# EAGLE design aard-mod (EAGLE 6.3)
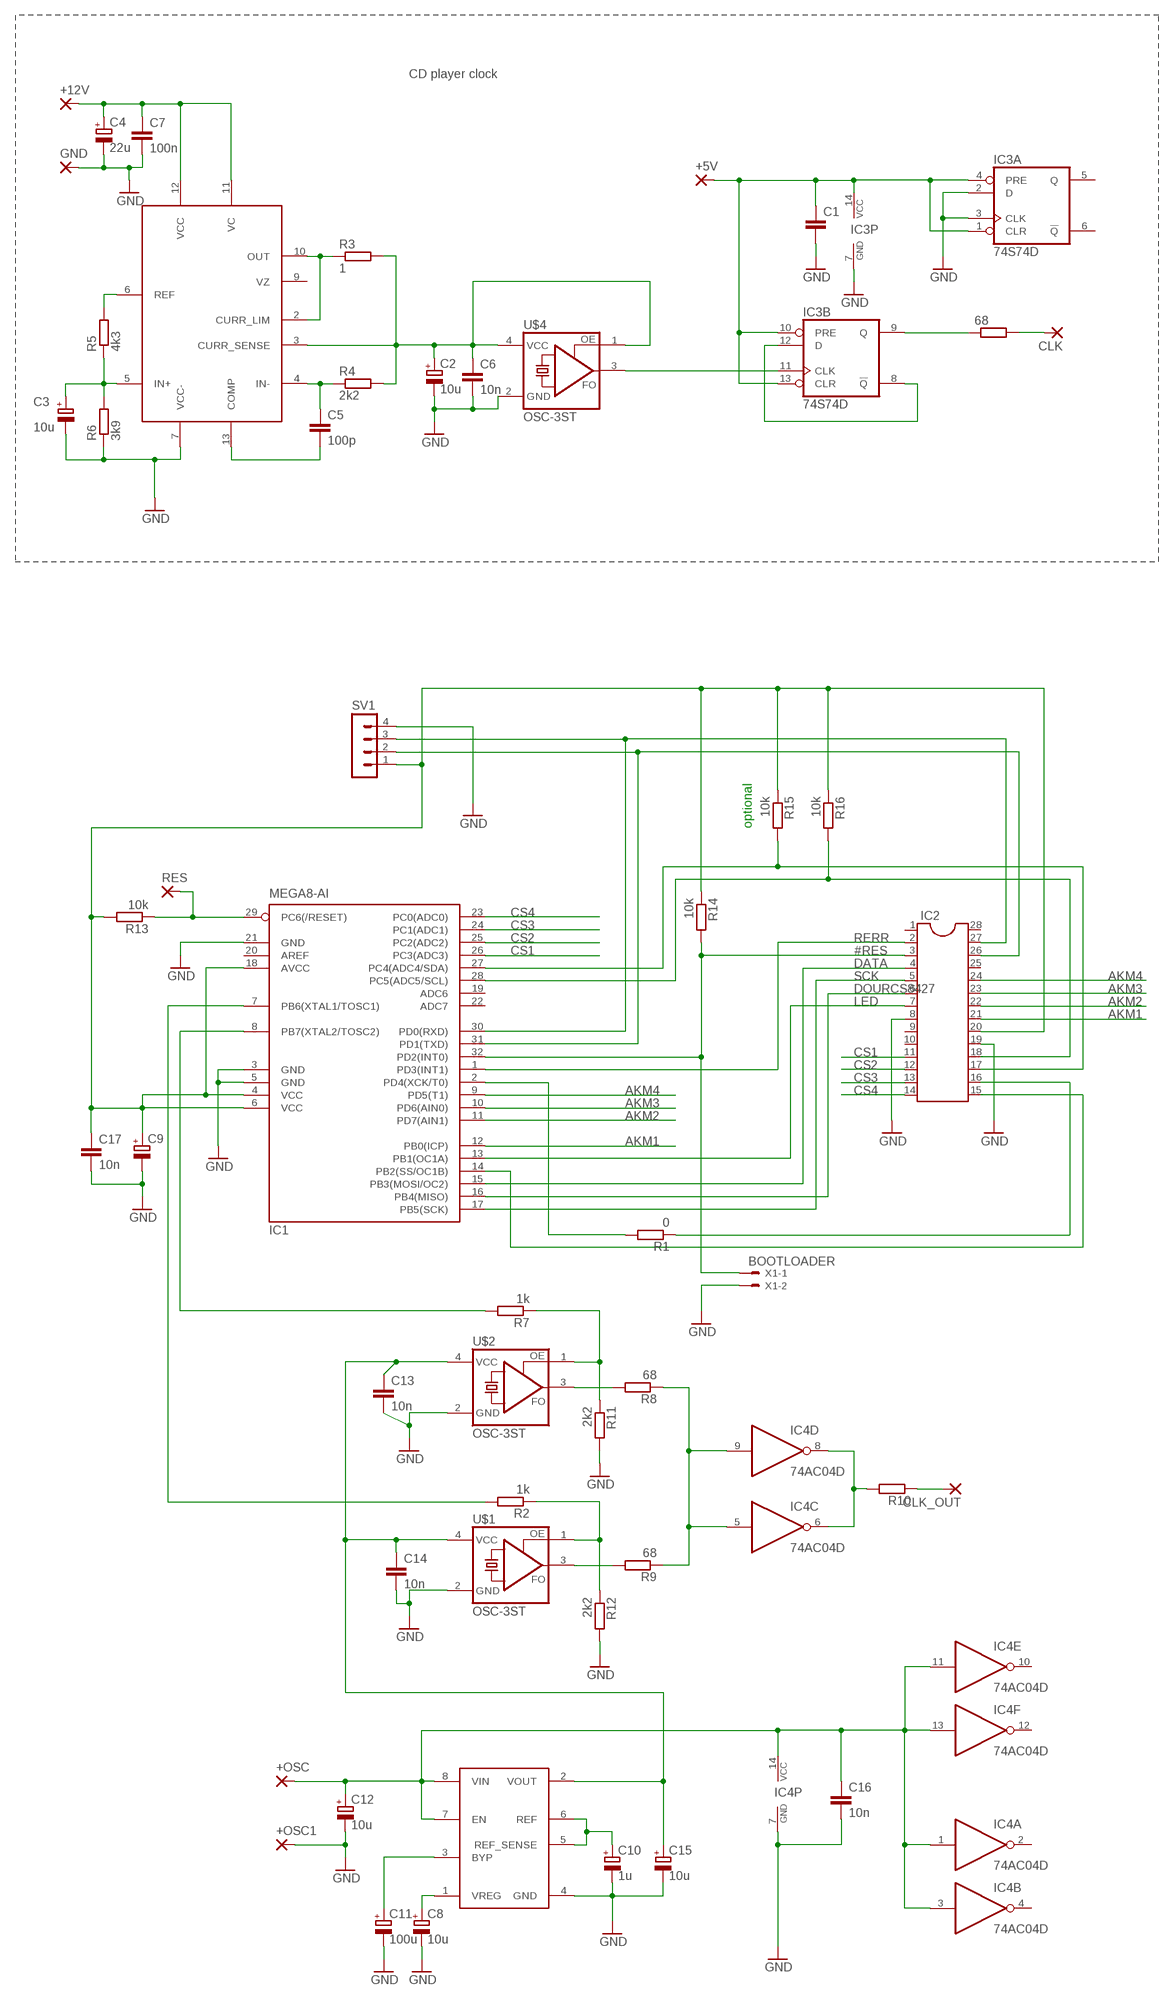
[diagram p0: schematic, sheet 1]

## Parts
68  R-EU_M1206  [M1206]
+5V  2,54/1,0  [2,54/1,0]
+12V  2,54/1,0  [2,54/1,0]
+OSC  2,54/1,0  [2,54/1,0]
+OSC1  2,54/1,0  [2,54/1,0]
C1  C-EUC1206K  [C1206K]
C2  10u  CPOL-EUSMCB  [SMC_B]
C3  10u  CPOL-EUSMCD  [SMC_D]
C4  22u  CPOL-EUSMCD  [SMC_D]
C5  100p  C-EUC0805K  [C0805K]
C6  10n  C-EUC0805K  [C0805K]
C7  100n  C-EUC1206K  [C1206K]
C8  10u  CPOL-EUSMCB  [SMC_B]
C9  CPOL-EUSMCB  [SMC_B]
C10  1u  CPOL-EUSMCB  [SMC_B]
C11  100u  CPOL-EUSMCD  [SMC_D]
C12  10u  CPOL-EUSMCD  [SMC_D]
C13  10n  C-EUC1206  [C1206]
C14  10n  C-EUC1206  [C1206]
C15  10u  CPOL-EUSMCB  [SMC_B]
C16  10n  C-EUC1206  [C1206]
C17  10n  C-EUC0805K  [C0805K]
CLK  2,54/1,0  [2,54/1,0]
CLK_OUT  2,54/1,0  [2,54/1,0]
GND  2,54/1,0  [2,54/1,0]
IC1  MEGA8-AI  [TQFP32-08]
IC2  DIL28-3  [DIL28-3]
IC3  74S74D  [SO14]
IC4  74AC04D  [SO14]
R1  0  R-EU_R1206  [R1206]
R2  1k  R-EU_R1206  [R1206]
R3  1  R-EU_M1206  [M1206]
R4  2k2  R-EU_R0805  [R0805]
R5  4k3  R-EU_R0805  [R0805]
R6  3k9  R-EU_R0805  [R0805]
R7  1k  R-EU_R1206  [R1206]
R8  68  R-EU_R1206  [R1206]
R9  68  R-EU_R1206  [R1206]
R10  R-EU_R0805  [R0805]
R11  2k2  R-EU_R0805  [R0805]
R12  2k2  R-EU_R0805  [R0805]
R13  10k  R-EU_R1206  [R1206]
R14  10k  R-EU_R1206  [R1206]
R15  10k  R-EU_R1206  [R1206]
R16  10k  R-EU_R1206  [R1206]
RES  2,54/1,0  [2,54/1,0]
SV1  MA04-1  [MA04-1]
U$1  OSC-3ST  [OSC2X2.5]
U$2  OSC-3ST  [OSC2X2.5]
U$3  723  [SO14]
U$4  OSC-3ST  [OSC2X2.5]
U$5  ADM7150  [SO8-COOL]
X1  BOOTLOADER  22-23-2021  [22-23-2021]

## Nets
5V: +12V.1(P) C4.+ C7.1 U$3.11(VC) U$3.12(VCC)
#RES: IC1.32(PD2(INT0)) IC2.3 R14.2 X1.1
AKM1: IC1.12(PB0(ICP)) IC2.21
AKM2: IC1.11(PD7(AIN1)) IC2.22
AKM3: IC1.10(PD6(AIN0)) IC2.23
AKM4: IC1.9(PD5(T1)) IC2.24
CS1: IC1.26(PC3(ADC3)) IC2.11
CS2: IC1.25(PC2(ADC2)) IC2.12
CS3: IC1.24(PC1(ADC1)) IC2.13
CS4: IC1.23(PC0(ADC0)) IC2.14
DATA: IC1.15(PB3(MOSI/OC2)) IC2.4
DOURCS8427: IC1.16(PB4(MISO)) IC2.6
GND: +OSC1.1(P) C1.2 C2.- C3.- C4.- C6.2 C7.2 C8.- C9.- C10.- C11.- C12.- C13.2 C14.2 C15.- C16.2 C17.2 GND.1(P) IC1.3(GND) IC1.5(GND) IC1.21(GND) IC2.8 IC2.19 IC3.2(A:D) IC3.3(A:CLK) IC3.7(P:GND) IC4.7(P:GND) R6.1 R11.2 R12.2 SV1.4 U$1.2(GND) U$2.2(GND) U$3.7(VCC-) U$4.2(GND) U$5.4(GND) X1.2
LED: IC1.13(PB1(OC1A)) IC2.7
N$1: IC1.2(PD4(XCK/T0)) R1.2
N$3: IC1.14(PB2(SS/OC1B)) IC2.15
N$5: IC1.28(PC5(ADC5/SCL)) IC2.18 R16.2
N$6: IC1.27(PC4(ADC4/SDA)) IC2.17 R15.2
N$13: IC1.30(PD0(RXD)) IC2.27 SV1.3
N$14: IC1.8(PB7(XTAL2/TOSC2)) R7.2
N$15: IC1.31(PD1(TXD)) IC2.26 SV1.2
N$17: IC2.16 R1.1
N$18: IC1.7(PB6(XTAL1/TOSC1)) R2.2
N$19: C10.+ U$5.5(REF_SENSE) U$5.6(REF)
N$21: C8.+ U$5.1(VREG)
N$22: C11.+ U$5.3(BYP)
N$23: +OSC.1(P) C12.+ C16.1 IC4.1(A:I) IC4.3(B:I) IC4.11(E:I) IC4.13(F:I) IC4.14(P:VCC) U$5.7(EN) U$5.8(VIN)
N$24: C13.1 C14.1 C15.+ U$1.4(VCC) U$2.4(VCC) U$5.2(VOUT)
N$25: C9.+ C17.1 IC1.4(VCC) IC1.6(VCC) IC1.18(AVCC) IC2.20 R13.2 R14.1 R15.1 R16.1 SV1.1
N$26: IC3.8(B:!Q) IC3.12(B:D)
N$27: IC3.11(B:CLK) U$4.3(FO)
N$28: +5V.1(P) C1.1 IC3.1(A:CLR) IC3.4(A:PRE) IC3.10(B:PRE) IC3.13(B:CLR) IC3.14(P:VCC)
N$29: IC4.6(C:O) IC4.8(D:O) R10.2
N$30: CLK_OUT.1(P) R10.1
N$31: C5.2 U$3.13(COMP)
N$32: R3.1 U$3.2(CURR_LIM) U$3.10(OUT)
N$33: C5.1 R4.1 U$3.4(IN-)
N$34: C2.+ C6.1 R3.2 R4.2 U$3.3(CURR_SENSE) U$4.1(OE) U$4.4(VCC)
N$35: R5.2 U$3.6(REF)
N$36: C3.+ R5.1 R6.2 U$3.5(IN+)
N$37: R8.2 U$2.3(FO)
N$38: R7.1 R11.1 U$2.1(OE)
N$39: R2.1 R12.1 U$1.1(OE)
N$40: 68.2 CLK.1(P)
N$41: R9.2 U$1.3(FO)
N$42: IC4.5(C:I) IC4.9(D:I) R8.1 R9.1
N$44: IC1.29(PC6(/RESET)) R13.1 RES.1(P)
N$45: 68.1 IC3.9(B:Q)
RERR: IC1.1(PD3(INT1)) IC2.2
SCK: IC1.17(PB5(SCK)) IC2.5
Unconnected: IC1.19(ADC6) IC1.20(AREF) IC1.22(ADC7) IC2.1 IC2.9 IC2.10 IC2.25 IC2.28 IC3.5(A:Q) IC3.6(A:!Q) IC4.2(A:O) IC4.4(B:O) IC4.10(E:O) IC4.12(F:O) U$3.9(VZ)

## Notes on the sheet
- CD player clock
- optional

## Library data of the parts
68 R1-R16 = rcl:R-EU_: RESISTOR, European symbol
+5V +12V +OSC +OSC1 CLK CLK_OUT GND RES = wirepad:2,54/1,0: THROUGH-HOLE PAD
C1 C5-C7 C13 C14 C16 C17 = rcl:C-EU: CAPACITOR, European symbol
C2-C4 C8-C12 C15 = rcl:CPOL-EU: POLARIZED CAPACITOR, European symbol
IC1 = atmel:MEGA8: MICROCONTROLLER 8 Kbytes FLASH, 1 kbytes SRAM, 512 bytes EEPROM, USART, 6-channel 10 bit ADC, 2-channel 8 bit ADC Pin compatible with Atmega48, ATMega88, ATMega168 Source: avr.lbr; MPN: ATMEGA8-16AU; OC_FARNELL: 9171371; OC_NEWARK: 73M8863
IC2 = ic-package:DIL28: Dual In Line
IC3 = 74xx-eu:74*74: Dual D type positive edge triggered FLIP FLOP, preset and clear
IC4 = 74xx-eu:74*04: Hex INVERTER
SV1 = con-lstb:MA04-1: PIN HEADER; OC_FARNELL: unknown; OC_NEWARK: unknown
U$1 U$2 U$4 = ndk:OSC-3ST
U$3 = v-reg-3:723
U$5 = analog-devices:ADM7150
X1 = con-molex:22-23-2021: .100" (2.54mm) Center Header - 2 Pin; MF: MOLEX; MPN: 22-23-2021; OC_FARNELL: 1462926; OC_NEWARK: 25C3832

## Board
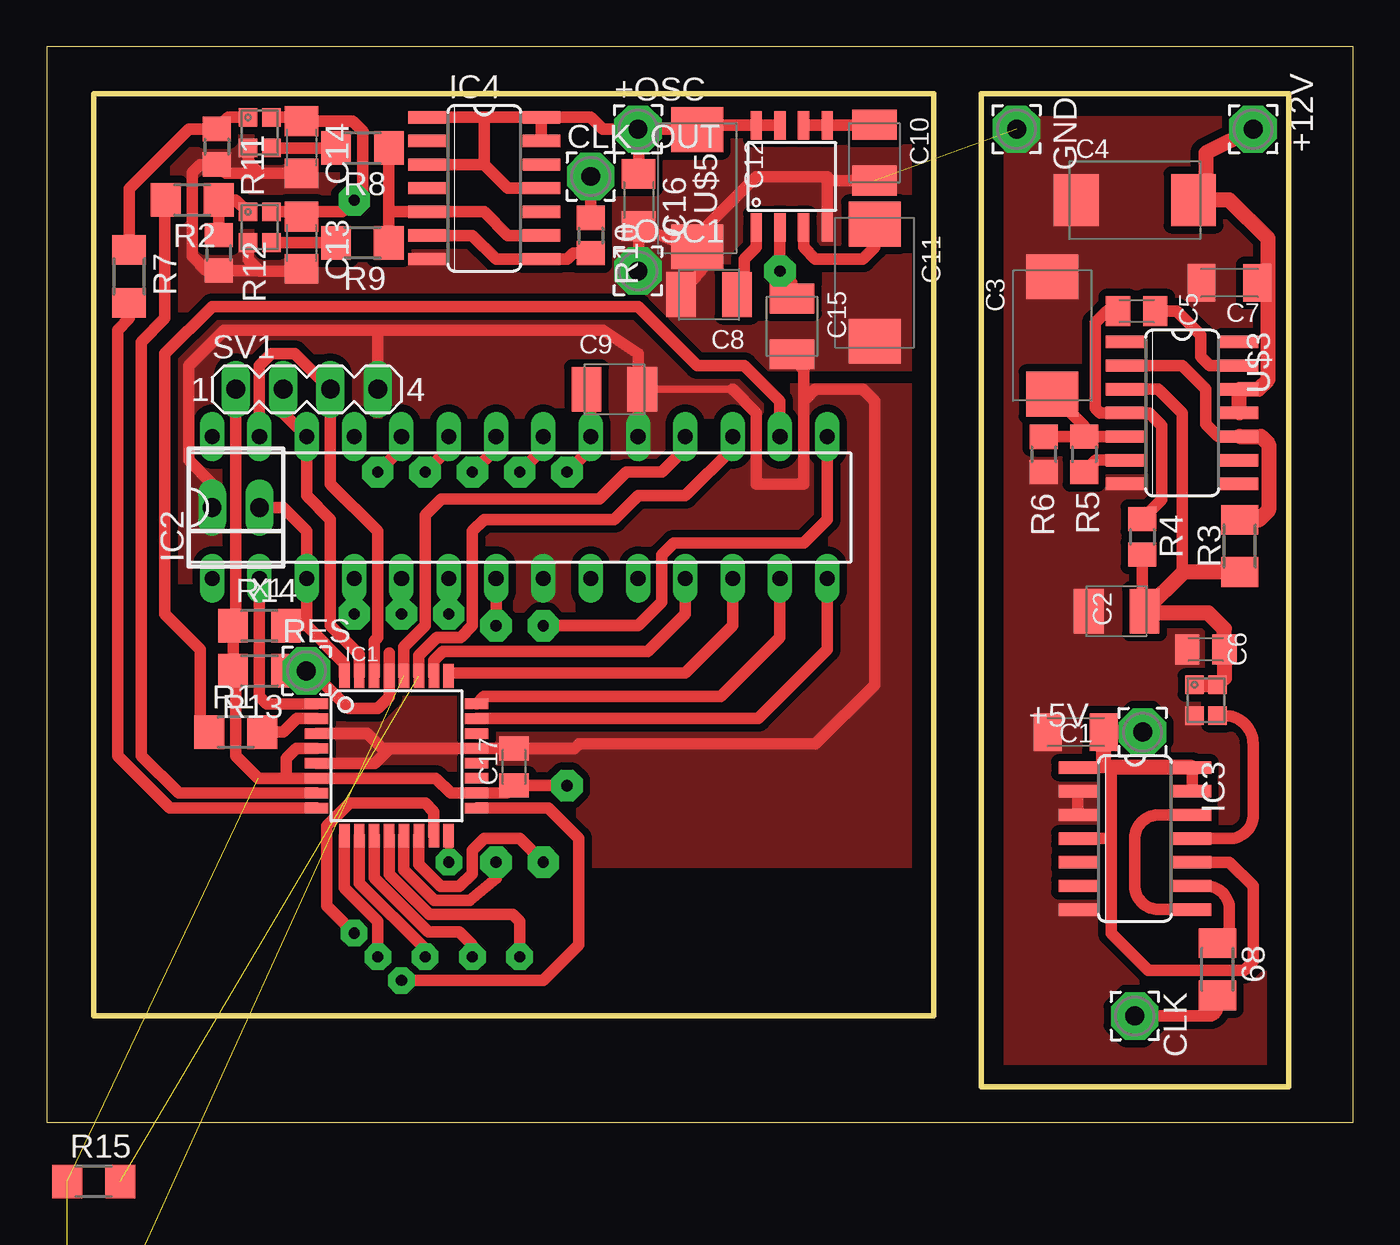
[diagram p1: board, top side]
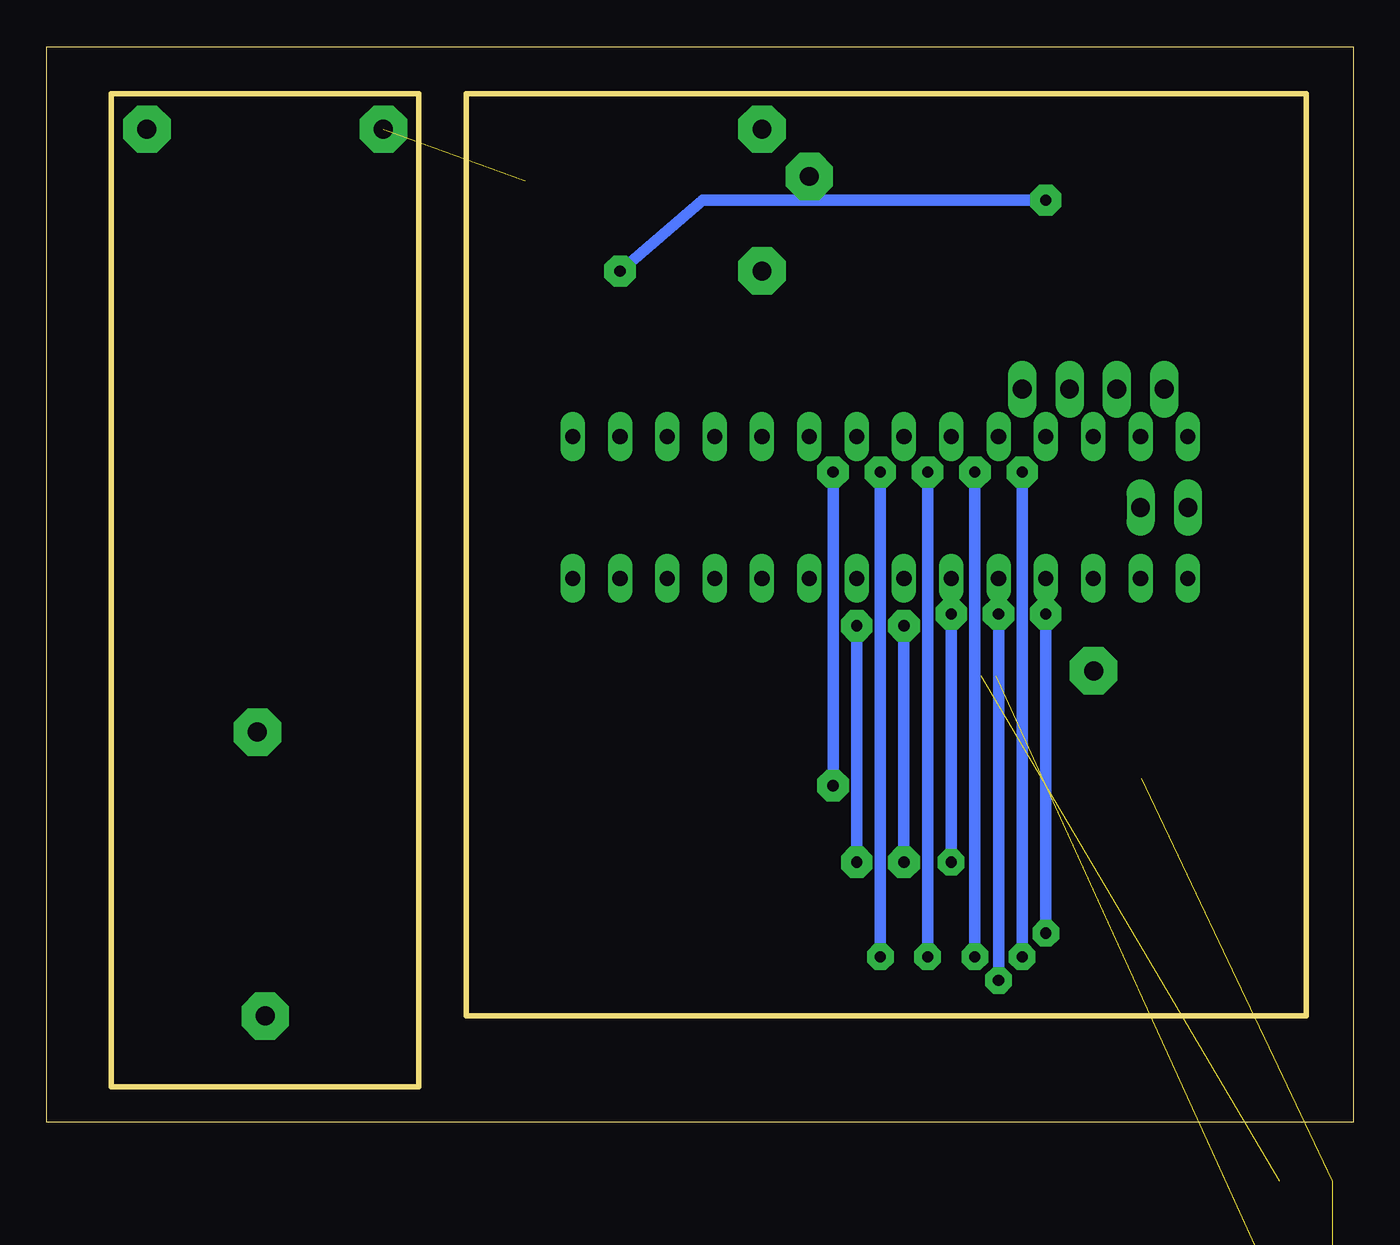
[diagram p2: board, bottom side, seen from below]

Size 70.16 x 57.78 mm. Coordinates in mm from the lower left corner, seen from the top.
Outline: 0,0 70.16,0 70.16,57.78 0,57.78 0,0
Outline: 2.54,55.25 47.62,55.25 47.62,5.71 2.54,5.71 2.54,55.25
Outline: 50.17,55.25 66.67,55.25 66.67,1.91 50.17,1.91 50.17,55.25
Copper layers (1*16): Top 0.035mm / dielectric 1.5mm / Bottom 0.035mm
Design rules "default": minimum track width 10mil, minimum drill 24mil, track to track 8mil, track to pad 8mil, pad to pad 8mil, via to via 8mil, smd to smd 8mil, copper to edge 40mil, drill to drill 8mil, minimum pad ring 10mil, minimum via ring 8mil, stop-mask expansion 4mil, vias tented up to drill 0mil, thermal gap 10mil

### Footprints (pad centres in the part's own frame; a part is rotated, then mirrored left to right if it is on the bottom)
M1206 = smd 1.6 x 2: 1 -1.4,0; 2 1.4,0
2,54/1,0 = drill 1.016 pad 2.54 octagon: 1 0,0
C1206K = smd 1.5 x 2: 1 -1.5,0; 2 1.5,0
SMC_B = smd 1.6 x 2.4: + -1.5,0; - 1.5,0
SMC_D = smd 2.4 x 2.8: + -3.15,0; - 3.15,0
C0805K = smd 1.3 x 1.6: 1 -1,0; 2 1,0
C1206 = smd 1.6 x 1.8: 1 -1.4,0; 2 1.4,0
TQFP32-08 = smd 1.27 x 0.559: 1 -4.293,2.8; 2 -4.293,2; 3 -4.293,1.2; 4 -4.293,0.4; 5 -4.293,-0.4; 6 -4.293,-1.2; 7 -4.293,-2; 8 -4.293,-2.8; 17 4.293,-2.8; 18 4.293,-2; 19 4.293,-1.2; 20 4.293,-0.4; 21 4.293,0.4; 22 4.293,1.2; 23 4.293,2; 24 4.293,2.8 | smd 0.559 x 1.27: 9 -2.8,-4.293; 10 -2,-4.293; 11 -1.2,-4.293; 12 -0.4,-4.293; 13 0.4,-4.293; 14 1.2,-4.293; 15 2,-4.293; 16 2.8,-4.293; 25 2.8,4.293; 26 2,4.293; 27 1.2,4.293; 28 0.4,4.293; 29 -0.4,4.293; 30 -1.2,4.293; 31 -2,4.293; 32 -2.8,4.293
DIL28-3 = drill 0.813 long: 1 -16.51,-3.81; 2 -13.97,-3.81; 3 -11.43,-3.81; 4 -8.89,-3.81; 5 -6.35,-3.81; 6 -3.81,-3.81; 7 -1.27,-3.81; 8 1.27,-3.81; 9 3.81,-3.81; 10 6.35,-3.81; 11 8.89,-3.81; 12 11.43,-3.81; 13 13.97,-3.81; 14 16.51,-3.81; 15 16.51,3.81; 16 13.97,3.81; 17 11.43,3.81; 18 8.89,3.81; 19 6.35,3.81; 20 3.81,3.81; 21 1.27,3.81; 22 -1.27,3.81; 23 -3.81,3.81; 24 -6.35,3.81; 25 -8.89,3.81; 26 -11.43,3.81; 27 -13.97,3.81; 28 -16.51,3.81
SO14 = smd 0.66 x 2.032: 1 -3.81,-3.073; 2 -2.54,-3.073; 3 -1.27,-3.073; 4 0,-3.073; 5 1.27,-3.073; 6 2.54,-3.073; 7 3.81,-3.073; 8 3.81,3.073; 9 2.54,3.073; 10 1.27,3.073; 11 0,3.073; 12 -1.27,3.073; 13 -2.54,3.073; 14 -3.81,3.073
R1206 = smd 1.6 x 1.803: 1 -1.422,0; 2 1.422,0
R0805 = smd 1.3 x 1.5: 1 -0.95,0; 2 0.95,0
MA04-1 = drill 1.016 long: 1 -3.81,0; 2 -1.27,0; 3 1.27,0; 4 3.81,0
OSC2X2.5 = smd 1 x 1: 1 0,-1.25; 2 1.65,-1.25; 3 1.65,0; 4 0,0
SO8-COOL = smd 0.61 x 1.524: 1 -1.905,-2.743; 2 -0.635,-2.743; 3 0.635,-2.743; 4 1.905,-2.743; 5 1.905,2.743; 6 0.635,2.743; 7 -0.635,2.743; 8 -1.905,2.743
22-23-2021 = drill 1 long: 1 -1.27,0; 2 1.27,0

### Placement (x,y rotation side)
68  62.86,8.23 270 top
+5V  58.83,20.96 270 top
+12V  64.77,53.34 270 top
+OSC  31.75,53.34 0 top
+OSC1  31.75,45.72 0 top
C1  55.25,20.95 180 top
C2  57.44,27.45 180 top
C3  53.99,42.26 90 top
C4  58.42,49.53 180 top
C5  58.52,43.57 0 top
C6  62.23,25.4 180 top
C7  63.5,45.08 180 top
C8  35.56,44.45 180 top
C9  30.48,39.37 0 top
C10  44.45,52.07 270 top
C11  44.45,45.08 270 top
C12  34.93,50.17 270 top
C13  13.69,47.23 270 top
C14  13.69,52.37 270 top
C15  40.02,42.75 270 top
C16  31.79,49.53 270 top
C17  25.1,19.09 90 top
CLK  58.42,5.71 270 top
CLK_OUT  29.21,50.8 0 top
GND  52.07,53.34 270 top
IC1  18.79,19.68 0 top
IC2  25.4,33.02 0 top
IC3  58.42,15.24 270 top
IC4  23.5,50.17 270 top
R1  10.16,20.95 0 top
R2  7.81,49.54 180 top
R3  64.05,30.96 270 top
R4  58.82,31.45 270 top
R5  55.7,35.88 270 top
R6  53.54,35.87 90 top
R7  4.43,45.43 270 top
R8  16.96,52.32 180 top
R9  16.95,47.24 180 top
R10  29.21,47.62 270 top
R11  9.14,52.4 270 top
R12  9.24,46.69 270 top
R13  11.43,24.25 180 top
R14  11.43,26.67 0 top
R15  2.54,-3.18 0 top  (outside the outline)
R16  2.54,-9.53 0 top  (outside the outline)
RES  13.95,24.25 0 top
SV1  13.97,39.37 0 top
U$1  12.06,48.89 270 top
U$2  12.06,53.97 270 top
U$3  60.96,38.1 270 top
U$4  62.87,23.49 270 top
U$5  40.01,50.8 0 top
X1  10.16,33.02 180 top

### Tracks (layer width: path | path; a pad name or v marks a point on that pad's centre or on a via)
5V
  Top 0.61: C7.1 65.57,45.72
  Top 0.813: U$3.11 U$3.12 65.05,39.37 65.57,39.89 65.57,45.72 65.57,47.46 63.5,49.53 62.23,49.53 | 62.23,49.53 C4.+ | +12V.1 62.23,52.07 62.23,49.53
#RES
  Top 0.406: 13.97,30.48 IC2.3
  Top 0.61: 13.97,26.67 IC2.3 13.97,31.75 12.7,33.02 X1.1 | 13.97,26.67 R14.2 | IC1.32 15.99,24.65 13.97,26.67
AKM1  (via drill 0.6 pad 1.42, 0.6 pad 1.68)
  Top 0.61: IC1.12 18.39,13.33 20.55,11.17 25.03,11.17 25.4,10.8 v25.4,8.89 | IC2.21 26.67,36.2 v25.4,34.92
  Bottom 0.61: v25.4,34.92 v25.4,8.89
AKM2  (via drill 0.6 pad 1.42, 0.6 pad 1.68)
  Top 0.61: IC1.11 17.59,13.13 20.48,10.23 22.16,10.23 22.86,9.52 v22.86,8.89 | IC2.22 24.13,36.2 v22.86,34.92
  Bottom 0.61: v22.86,34.92 v22.86,8.89
AKM3  (via drill 0.6 pad 1.42, 0.6 pad 1.68)
  Top 0.61: IC1.10 16.78,12.84 20.32,9.31 v20.32,8.89 | IC2.23 21.59,36.2 v20.32,34.92
  Bottom 0.61: v20.32,34.92 v20.32,8.89
AKM4  (via drill 0.6 pad 1.42, 0.6 pad 1.68)
  Top 0.406: 17.78,9.61 v17.78,8.89
  Top 0.61: IC1.9 15.99,12.59 17.78,10.8 v17.78,8.89 | IC2.24 19.05,36.2 v17.78,34.92
  Bottom 0.61: v17.78,34.92 v17.78,8.89
CS1
  Top 0.61: IC1.26 20.79,24.81 21.26,25.28 32.27,25.28 34.29,27.3 IC2.11
CS2
  Top 0.406: 21.74,24.13 IC1.25
  Top 0.61: IC2.12 36.83,26.67 34.29,24.13 21.74,24.13
CS3
  Top 0.61: IC2.13 39.37,26.03 36.2,22.86 23.46,22.86 IC1.24
CS4
  Top 0.61: IC1.23 38.19,21.68 41.91,25.4 IC2.14
DATA  (via drill 0.6 pad 1.42, 0.6 pad 1.68)
  Top 0.61: IC2.4 v16.51,27.3 | IC1.15 20.79,16.68 20.32,17.14 16.27,17.14 15.04,15.91 15.04,11.63 v16.51,10.16
  Bottom 0.61: v16.51,27.3 v16.51,10.16
DOURCS8427  (via drill 0.6 pad 1.42, 0.6 pad 1.68)
  Top 0.406: IC1.16 v21.59,13.97
  Top 0.61: IC2.6 v21.59,27.3
  Bottom 0.61: v21.59,27.3 v21.59,13.97
GND  (1 unrouted)
  Top 0.406: 36.83,39.37 C9.-
  Top 0.61: IC3.2 IC3.3 | 18.41,20.08 IC1.21 C17.2 28.34,20.09 28.57,20.32 41.28,20.32 44.45,23.49 44.45,38.73 43.82,39.37 41.28,39.37 40.64,38.73 | 18.41,20.08 18.02,20.08 17.22,20.88 IC1.3 | IC1.5 17.61,19.28 18.41,20.08 | X1.2 8.89,34.29 7.62,35.56 7.62,40.64 9.53,42.55 17.78,42.55 | IC2.19 31.75,39.14 C9.- 31.75,39.6 31.75,41.28 29.84,42.55 17.78,42.55 | C14.2 11.43,50.97 | 11.43,50.97 9.62,50.97 R11.2 9.12,51.44 8.26,51.44 7.81,50.99 7.81,46.51 8.58,45.74 R12.2 11.41,45.74 | U$2.2 10.81,51.58 11.43,50.97 | U$1.2 10.81,46.33 11.41,45.74 | C13.2 13.57,45.72 11.43,45.72 11.41,45.74 | SV1.4 17.78,42.55 | U$5.4 41.91,50.8 | 41.91,50.8 38.1,50.8 34.93,47.62 C12.- | C12.- 34.93,46.99 34.8,46.86 C16.2 31.79,45.76 +OSC1.1 | C8.- 35.33,45.97 C12.- | C10.- 42.14,50.57 41.91,50.8 | 36.83,39.37 38.1,38.1 38.1,34.29 40.64,34.29 40.64,38.73 | 40.64,38.73 40.64,40.41 C15.-
  pour Top (isolate 0.406, no thermals): 66.04,54.61 66.04,2.54 50.8,2.54 50.8,54.61
  pour Top (isolate 0.406, no thermals): 46.36,40.64 34.93,40.64 31.75,43.81 6.35,43.81 6.35,53.97 46.36,53.97
  pour Top (isolate 0.406, no thermals): 6.35,43.81 31.75,43.81 34.93,40.64 37.47,40.64 38.74,39.37 46.36,39.37 46.36,13.97 15.24,13.97 15.24,29.21 6.35,29.21
LED  (via drill 0.6 pad 1.68)
  Top 0.61: IC2.7 v24.13,26.67 | IC1.13 19.19,13.55 20.8,11.93 22.73,11.93 24.13,13.11 v24.13,13.97
  Bottom 0.61: v24.13,26.67 v24.13,13.97
N$1
  Top 0.61: IC1.2 13.43,21.68 12.7,20.95 R1.2
N$2  (via drill 0.6 pad 1.68)
  other vias: 16.51,49.53
N$3  (via drill 0.6 pad 1.68)
  Top 0.61: IC2.15 41.91,32.38 40.64,31.12 33.66,31.12 33.02,30.48 33.02,27.94 31.75,26.67 v26.67,26.67 | IC1.14 19.99,13.84 21.16,12.67 22.14,12.67 22.86,13.34 22.86,14.6 23.5,15.24 25.4,15.24 v26.67,13.97
  Bottom 0.61: v26.67,26.67 v26.67,13.97
N$5  (1 unrouted)
  Top 0.61: IC1.28 19.19,25.54 20.32,26.67 20.32,32.6 21.19,33.47 29.66,33.47 31.11,34.92 33.02,34.92 34.29,36.2 IC2.18
N$6  (1 unrouted)
  Top 0.61: IC1.27 19.99,25.07 20.95,26.03 22.22,26.03 22.86,26.67 22.86,31.75 23.5,32.38 30.48,32.38 31.75,33.66 34.29,33.66 36.83,36.2 IC2.17
N$13
  Top 0.61: IC1.30 17.59,25.84 17.78,26.03 17.78,31.75 15.24,34.29 SV1.3 13.33,41.28 12.06,41.28 11.43,40.64 IC2.27
N$14
  Top 0.61: IC1.8 6.61,16.88 3.81,19.69 3.81,42.55 4.45,43.18 4.45,44 R7.2
N$15
  Top 0.61: IC1.31 16.79,25.12 15.24,26.67 15.24,32.38 13.97,33.66 IC2.26 12.7,38.1 SV1.2
N$17
  Top 0.61: R1.1 8.26,20.95 8.26,25.4 6.35,27.3 6.35,41.28 8.89,43.81 31.75,43.81 34.93,40.64 37.47,40.64 39.37,38.73 IC2.16
N$18
  Top 0.61: IC1.7 7.08,17.68 5.08,19.69 5.08,41.91 6.35,43.18 6.35,49.5 R2.2
N$19
  Top 0.61: U$5.6 U$5.5 44.42,53.54 C10.+
N$21
  Top 0.61: U$5.1 38.1,46.99 37.47,46.36 37.47,44.86 C8.+
N$22
  Top 0.61: U$5.3 40.64,46.99 41.28,46.36 43.82,46.36 44.45,46.99 C11.+
N$23
  Top 0.61: IC4.11 24.77,50.17 23.5,51.44 | 23.5,51.44 23.5,53.97 | 23.5,53.97 IC4.14 IC4.13 26.57,53.87 26.67,53.97 29.21,53.97 29.84,53.34 +OSC.1 | IC4.1 23.5,53.97 | IC4.3 23.5,51.44 | C16.1 31.79,52.67 +OSC.1 | U$5.7 U$5.8 35.15,53.54 C12.+ 34.95,53.34 | +OSC.1 34.95,53.34 | 35.56,53.34 34.95,53.34
N$24  (via drill 0.6 pad 1.68)
  Top 0.61: U$1.4 13.43,48.89 C13.1 13.71,48.63 13.97,48.89 15.88,48.89 v16.51,49.53 v16.52,49.53 16.99,50 16.99,53.2 16.99,53.21 16.44,53.77 C14.1 | U$2.4 13.48,53.97 C14.1 | 13.89,53.97 C14.1 | U$5.2 v39.37,45.72 40.01,45.08 C15.+
  Bottom 0.61: v39.37,45.72 34.93,49.53 v16.51,49.53
N$25  (via drill 0.6 pad 1.68)  (2 unrouted)
  Top 0.61: SV1.1 10.16,26.82 R14.1 R13.2 10.16,24.1 10.16,19.69 11.36,18.48 12.7,18.48 | v27.94,34.92 29.21,36.2 IC2.20 29.21,39.14 C9.+ | v27.94,18.08 v27.93,18.09 C17.1 24.69,17.68 IC1.18 21.69,17.68 20.89,18.48 IC1.6 12.7,18.48 | IC1.4 13.41,20.08 12.86,19.53 12.86,18.65 12.7,18.48
  Bottom 0.61: v27.94,18.08 v27.94,34.92
N$26
  Top 0.61: IC3.8 59.69,11.43 arc-90 58.42,12.7 58.42,15.24 arc-90 59.69,16.51 IC3.12
N$27
  Top 0.61: U$4.3 63.25,21.84 arc-90 64.77,20.32 64.77,16.51 arc-90 63.5,15.24 IC3.11
N$28
  Top 0.61: 57.15,15.24 57.15,10.16 59.14,8.17 64.29,8.17 64.77,8.65 64.77,12.7 63.5,13.97 IC3.10 | 57.15,15.24 57.15,19.05 56.52,19.05 | 56.75,19.28 56.52,19.05 | IC3.1 56.52,19.05 | IC3.4 57.15,15.24 | IC3.13 IC3.14
  Top 0.813: IC3.14 57.15,19.05 | 56.75,19.28 C1.1 +5V.1
N$29
  Top 0.61: IC4.6 22.86,47.62 24.13,46.36 IC4.8 | IC4.8 27.3,46.36 | R10.2 28.26,46.67 27.94,46.36 IC4.8
N$30
  Top 0.61: R10.1 CLK_OUT.1
N$31
  Top 0.61: U$3.13 62.45,40.64 61.95,41.14 61.95,42.27 60.66,43.57 C5.2
N$32
  Top 0.61: 65.08,32.35 R3.1 | U$3.2 60.96,40.64 62.23,39.37 62.23,37.49 62.89,36.83 U$3.10
  Top 0.813: U$3.10 65.2,36.83 65.6,36.43 65.6,32.87 65.08,32.35 | R3.1
N$33
  Top 0.61: R4.1 59.87,33.45 59.87,37.42 59.19,38.1 U$3.4 56.57,38.1 56.31,38.37 56.31,42.95 56.92,43.57 C5.1
N$34
  Top 0.61: 63.23,23.86 U$4.4 | 59.03,27.36 C2.+ 58.82,27.57 R4.2 | U$3.3 59.69,39.37 60.96,38.1 60.96,29.65 61.05,29.56
  Top 0.813: 63.23,23.86 C6.1 63.23,26.5 62.37,27.36 59.03,27.36 | R3.2 61.05,29.56 C2.+ | U$4.4 U$4.1
N$35
  Top 0.61: U$3.6 56.34,35.56 R5.2
N$36
  Top 0.305: R5.1
  Top 0.61: R5.1 U$3.5 | R5.1 55.7,37.39 C3.+ | R6.2 R5.1
N$37
  Top 0.61: U$2.3 R8.2
N$38
  Top 0.61: U$2.1 9.76,53.97 R11.1 7.62,53.34 4.43,50.15 R7.1
N$39
  Top 0.61: U$1.1 10.79,48.89 10.16,49.53 9.24,49.53 R2.1 R12.1 | R12.1
N$40
  Top 0.61: CLK.1 62.39,5.71 arc90 62.86,6.18 68.2 arc90 68.2
N$41
  Top 0.61: U$1.3 R9.2
N$42
  Top 0.61: R8.1 18.38,48.89 | 18.38,48.89 R9.1 | IC4.9 24.77,47.62 23.5,48.89 IC4.5 18.38,48.89
N$44
  Top 0.406: R13.1 RES.1
  Top 0.61: RES.1 14.2,24 14.45,24 16.23,22.23 17.78,22.23 18.39,22.83 IC1.29 | IC1.29 18.39,25.21 IC1.29
N$45
  Top 0.61: IC3.9 62.23,12.7 arc-90 63.5,11.43 63.5,10.16 63.39,10.16 arc90 68.1
RERR
  Top 0.61: IC1.1 11.81,22.48 11.43,22.86 IC2.2
SCK  (via drill 0.6 pad 1.42, 0.6 pad 1.68)
  Top 0.61: IC2.5 v19.05,27.3 | v19.05,7.62 26.67,7.62 28.57,9.52 28.57,15.24 26.93,16.88 IC1.17
  Bottom 0.61: v19.05,27.3 v19.05,7.62